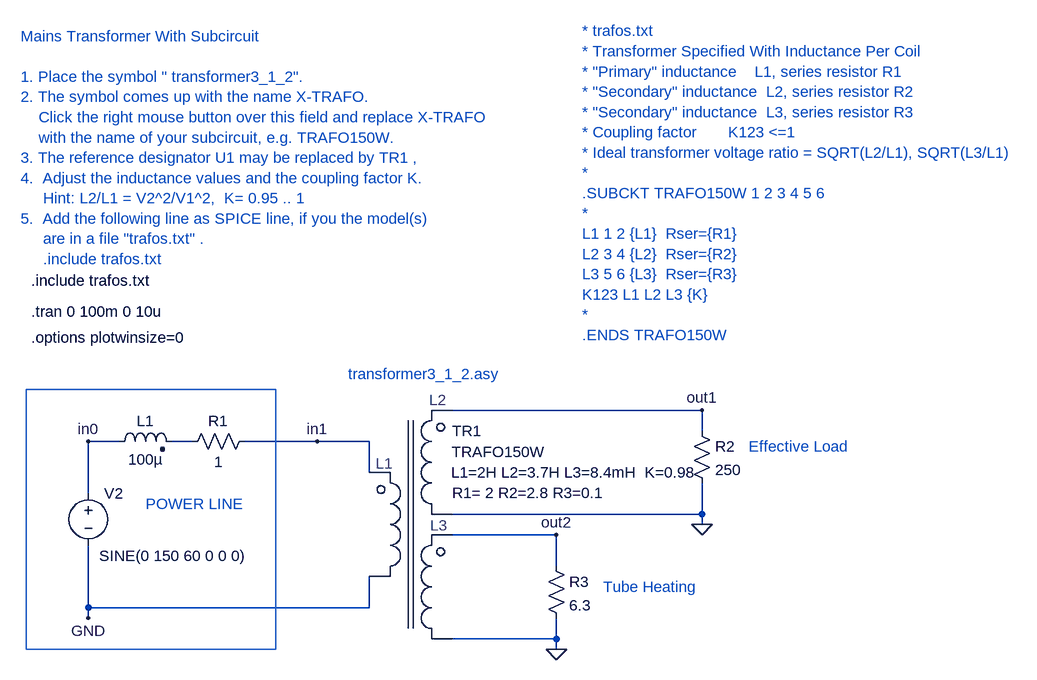
[diagram p0: schematic mains_trafo_3coils.asc]
mains_trafo_3coils.asc, the LTspice schematic file:
Version 4
SHEET 1 2888 2316
WIRE 752 608 752 688
WIRE 752 768 752 864
WIRE 912 608 880 608
WIRE 992 608 1104 608
WIRE 752 864 752 880
WIRE 1184 656 1184 608
WIRE 1184 608 1104 608
WIRE 1184 816 1184 864
WIRE 1184 864 752 864
WIRE 1312 752 1472 752
WIRE 1696 720 1312 720
WIRE 1312 560 1696 560
WIRE 1312 912 1472 912
WIRE 1472 800 1472 752
WIRE 1696 592 1696 560
WIRE 1472 880 1472 912
WIRE 1696 720 1696 672
WIRE 1472 912 1472 928
WIRE 1696 736 1696 720
WIRE 800 608 752 608
FLAG 752 880 GND
FLAG 752 608 in0
FLAG 1104 608 in1
FLAG 1696 560 out1
FLAG 1472 752 out2
FLAG 1472 928 0
FLAG 1696 736 0
SYMBOL res 1680 576 R0
SYMATTR InstName R2
SYMATTR Value 250
SYMBOL res 896 624 R270
WINDOW 0 32 56 VTop 0
WINDOW 3 0 56 VBottom 0
SYMATTR InstName R1
SYMATTR Value 1
SYMBOL VOLTAGE 752 672 R0
WINDOW 39 0 0 Left 0
WINDOW 123 28 112 Left 0
WINDOW 3 17 112 Left 0
SYMATTR Value SINE(0 150 60 0 0 0)
SYMATTR InstName V2
SYMBOL res 1456 784 R0
SYMATTR InstName R3
SYMATTR Value 6.3
SYMBOL transformer3_1_2 1168 560 R0
SYMATTR InstName TR1
SYMATTR Value TRAFO150W
SYMATTR SpiceLine L1=2H L2=3.7H L3=8.4mH  K=0.98
SYMATTR SpiceLine2 R1= 2 R2=2.8 R3=0.1
SYMBOL ind2 784 624 R270
WINDOW 0 32 56 VTop 0
WINDOW 3 4 56 VBottom 0
SYMATTR InstName L1
SYMATTR Value 100µ
SYMATTR Type ind
TEXT 664 408 Left 0 !.tran 0 100m 0 10u
TEXT 1152 504 Left 0 ;transformer3_1_2.asy
TEXT 648 -16 Left 0 ;Mains Transformer With Subcircuit\n \n1. Place the symbol " transformer3_1_2".\n2. The symbol comes up with the name X-TRAFO.\n    Click the right mouse button over this field and replace X-TRAFO\n    with the name of your subcircuit, e.g. TRAFO150W.\n3. The reference designator U1 may be replaced by TR1 ,\n4.  Adjust the inductance values and the coupling factor K.\n     Hint: L2/L1 = V2^2/V1^2,  K= 0.95 .. 1\n5.  Add the following line as SPICE line, if you the model(s) \n     are in a file "trafos.txt" .\n     .include trafos.txt
TEXT 1512 -24 Left 0 ;* trafos.txt\n* Transformer Specified With Inductance Per Coil\n* "Primary" inductance    L1, series resistor R1\n* "Secondary" inductance  L2, series resistor R2\n* "Secondary" inductance  L3, series resistor R3\n* Coupling factor       K123 <=1\n* Ideal transformer voltage ratio = SQRT(L2/L1), SQRT(L3/L1)\n*\n.SUBCKT TRAFO150W 1 2 3 4 5 6 \n*\nL1 1 2 {L1}  Rser={R1}\nL2 3 4 {L2}  Rser={R2}\nL3 5 6 {L3}  Rser={R3}\nK123 L1 L2 L3 {K}\n*\n.ENDS TRAFO150W
TEXT 664 360 Left 0 !.include trafos.txt
TEXT 664 448 Left 0 !.options plotwinsize=0
TEXT 840 704 Left 0 ;POWER LINE
TEXT 1544 832 Left 0 ;Tube Heating
TEXT 1768 616 Left 0 ;Effective Load
RECTANGLE Normal 1040 928 656 528

The netlist it stands for:
* mains_trafo_3coils.asc
R2 out1 0 250
R1 N001 in1 1
V2 in0 GND SINE(0 150 60 0 0 0)
R3 out2 0 6.3
XTR1 in1 GND out1 0 out2 0 TRAFO150W L1=2H L2=3.7H L3=8.4mH  K=0.98 R1= 2 R2=2.8 R3=0.1  ; pins A B C D E F
L1 in0 N001 100µ
.tran 0 100m 0 10u
* transformer3_1_2.asy
* Mains Transformer With Subcircuit
* 1. Place the symbol " transformer3_1_2".
* 2. The symbol comes up with the name X-TRAFO.
*     Click the right mouse button over this field and replace X-TRAFO
*     with the name of your subcircuit, e.g. TRAFO150W.
* 3. The reference designator U1 may be replaced by TR1 ,
* 4.  Adjust the inductance values and the coupling factor K.
*      Hint: L2/L1 = V2^2/V1^2,  K= 0.95 .. 1
* 5.  Add the following line as SPICE line, if you the model(s)
*      are in a file "trafos.txt" .
*      .include trafos.txt
* * trafos.txt
* * Transformer Specified With Inductance Per Coil
* * "Primary" inductance    L1, series resistor R1
* * "Secondary" inductance  L2, series resistor R2
* * "Secondary" inductance  L3, series resistor R3
* * Coupling factor       K123 <=1
* * Ideal transformer voltage ratio = SQRT(L2/L1), SQRT(L3/L1)
* *
* .SUBCKT TRAFO150W 1 2 3 4 5 6
* *
* L1 1 2 {L1}  Rser={R1}
* L2 3 4 {L2}  Rser={R2}
* L3 5 6 {L3}  Rser={R3}
* K123 L1 L2 L3 {K}
* *
* .ENDS TRAFO150W
.include trafos.txt
.options plotwinsize=0
* POWER LINE
* Tube Heating
* Effective Load
.backanno
.end